# EAGLE design noise-generator (EAGLE 7.5.0)
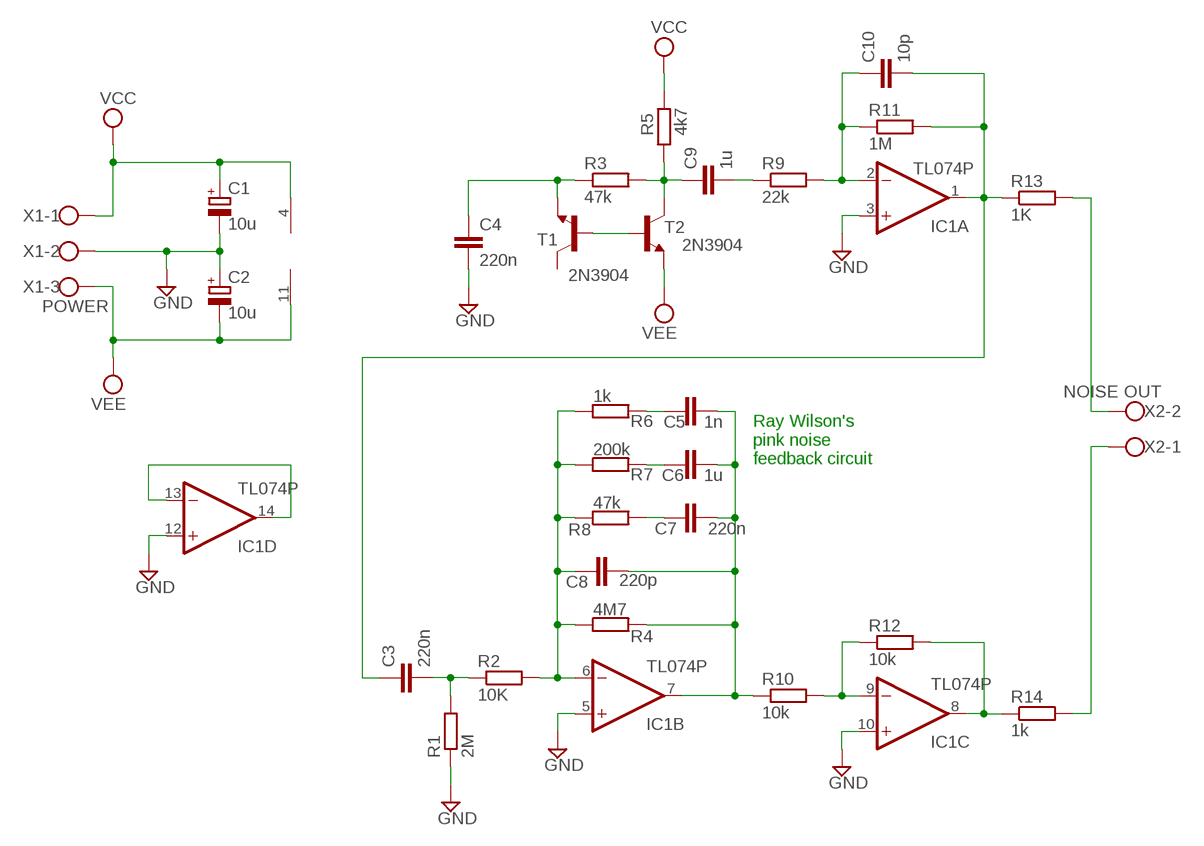
[diagram p0: schematic, sheet 1]

## Parts
C1  10u  CPOL-EUE1.8-4  [E1,8-4]
C2  10u  CPOL-EUE1.8-4  [E1,8-4]
C3  220n  C-EU050-024X044  [C050-024X044]
C4  220n  C-EU050-024X044  [C050-024X044]
C5  1n  C-EU050-024X044  [C050-024X044]
C6  1u  C-EU050-024X044  [C050-024X044]
C7  220n  C-EU050-024X044  [C050-024X044]
C8  220p  C-EU050-024X044  [C050-024X044]
C9  1u  C-EU050-024X044  [C050-024X044]
C10  10p  C-EU025-024X044  [C025-024X044]
IC1  TL074P  [DIL14]
R1  2M  R-EU_0204/7  [0204/7]
R2  10K  R-EU_0204/7  [0204/7]
R3  47k  R-EU_0204/7  [0204/7]
R4  4M7  R-EU_0204/7  [0204/7]
R5  4k7  R-EU_0204/7  [0204/7]
R6  1k  R-EU_0204/7  [0204/7]
R7  200k  R-EU_0204/7  [0204/7]
R8  47k  R-EU_0204/7  [0204/7]
R9  22k  R-EU_0204/7  [0204/7]
R10  10k  R-EU_0204/7  [0204/7]
R11  1M  R-EU_0204/7  [0204/7]
R12  10k  R-EU_0204/7  [0204/7]
R13  1K  R-EU_0204/7  [0204/7]
R14  1k  R-EU_0204/7  [0204/7]
T1  2N3904  [TO92]
T2  2N3904  [TO92]
X1  POWER  W237-103  [W237-103]
X2  NOISE OUT  W237-102  [W237-102]

## Nets
GND: C1.- C2.+ C4.2 IC1.3(A:+IN) IC1.5(B:+IN) IC1.10(C:+IN) IC1.12(D:+IN) R1.1 X1.2
N$1: C4.1 R3.1 T1.3(E)
N$2: IC1.9(C:-IN) R10.2 R12.1
N$3: C9.1 R3.2 R5.1 T2.1(C)
N$4: T1.2(B) T2.2(B)
N$5: C9.2 R9.1
N$6: C10.1 IC1.2(A:-IN) R9.2 R11.1
N$7: R13.2 X2.2
N$8: C3.1 C10.2 IC1.1(A:OUT) R11.2 R13.1
N$9: IC1.8(C:OUT) R12.2 R14.1
N$10: R14.2 X2.1
N$11: C8.1 IC1.6(B:-IN) R2.2 R4.1 R6.1 R7.1 R8.1
N$12: C3.2 R1.2 R2.1
N$13: IC1.13(D:-IN) IC1.14(D:OUT)
N$14: C6.1 R7.2
N$15: C5.1 R6.2
N$16: C7.1 R8.2
N$17: C5.2 C6.2 C7.2 C8.2 IC1.7(B:OUT) R4.2 R10.1
VCC: C1.+ IC1.4(P:V+) R5.2 X1.1
VEE: C2.- IC1.11(P:V-) T2.3(E) X1.3
Unconnected: T1.1(C)

## Notes on the sheet
- Ray Wilson's
  pink noise
  feedback circuit

## Library data of the parts
C1 C2 = rcl:CPOL-EU: POLARIZED CAPACITOR, European symbol
C3-C10 = rcl:C-EU: CAPACITOR, European symbol
IC1 = linear:TL074: OP AMP
R1-R14 = rcl:R-EU_: RESISTOR, European symbol
T1 T2 = transistor:2N3904: NPN TRANSISTOR
X1 = con-wago-500:W237-103: WAGO SCREW CLAMP; MPN: 237-103; OC_FARNELL: unknown; OC_NEWARK: 18M7116
X2 = con-wago-500:W237-102: WAGO SCREW CLAMP; MPN: 237-102; OC_FARNELL: unknown; OC_NEWARK: 70K9898

## Board
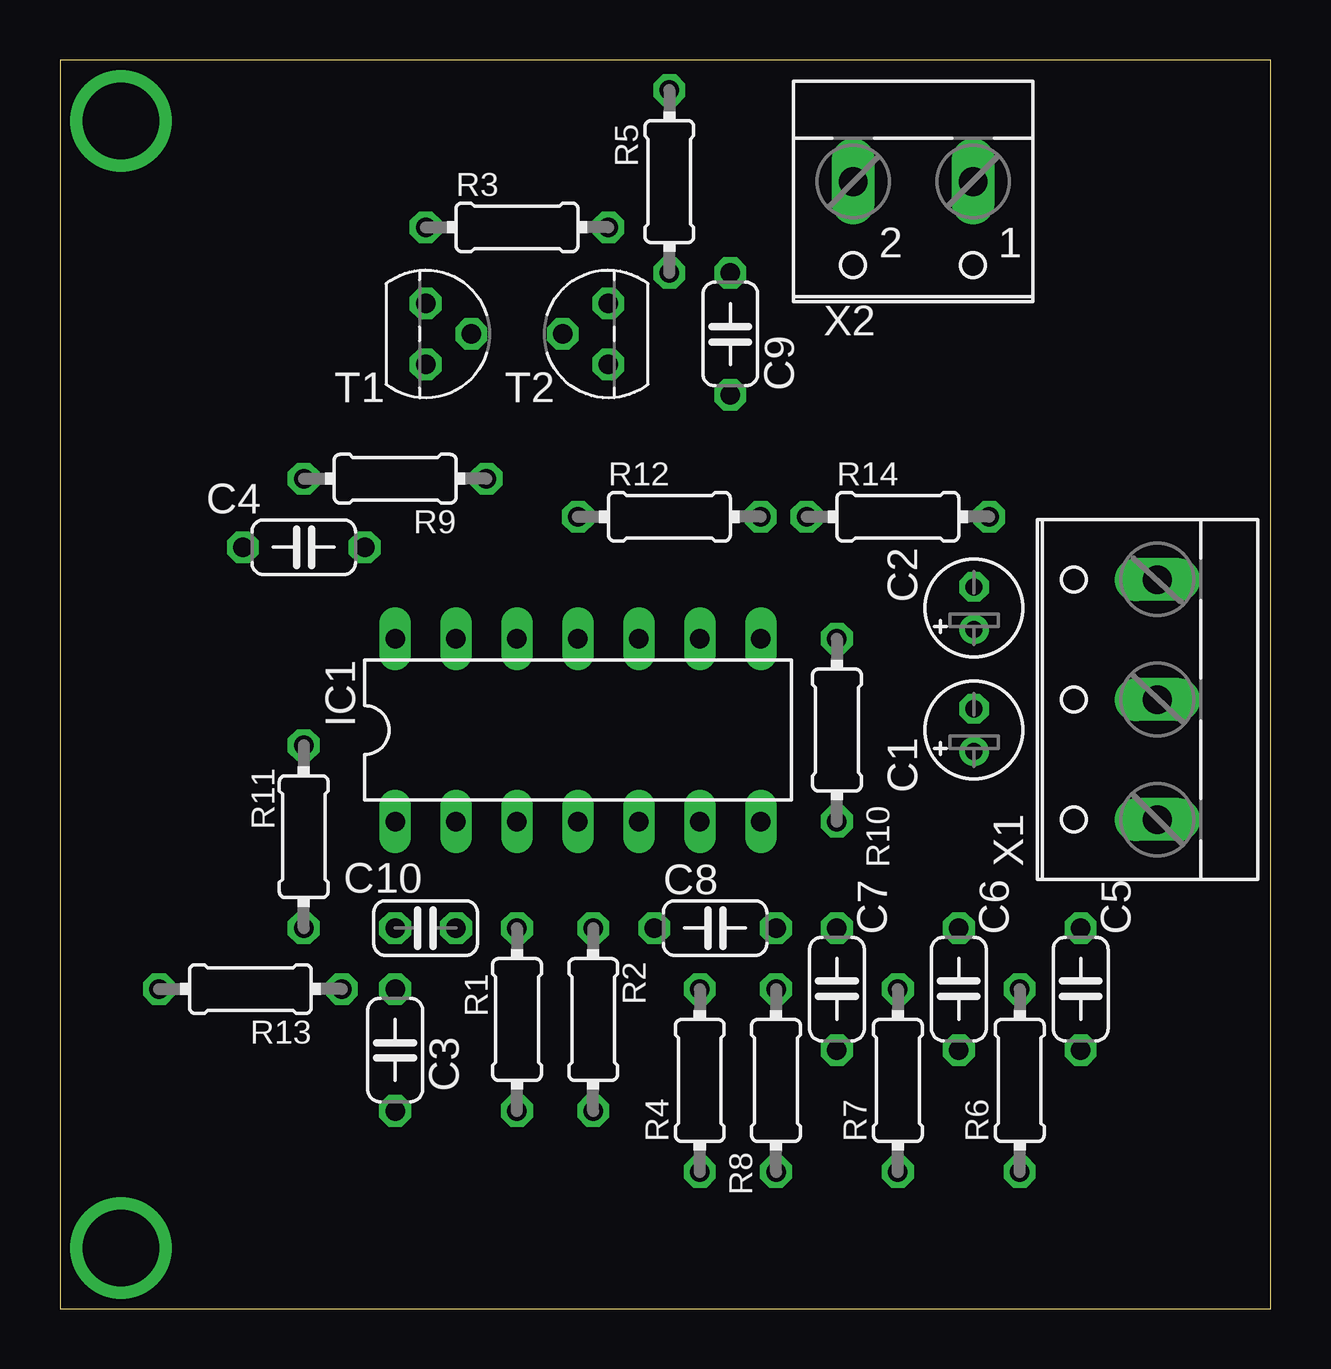
[diagram p1: board, top side]
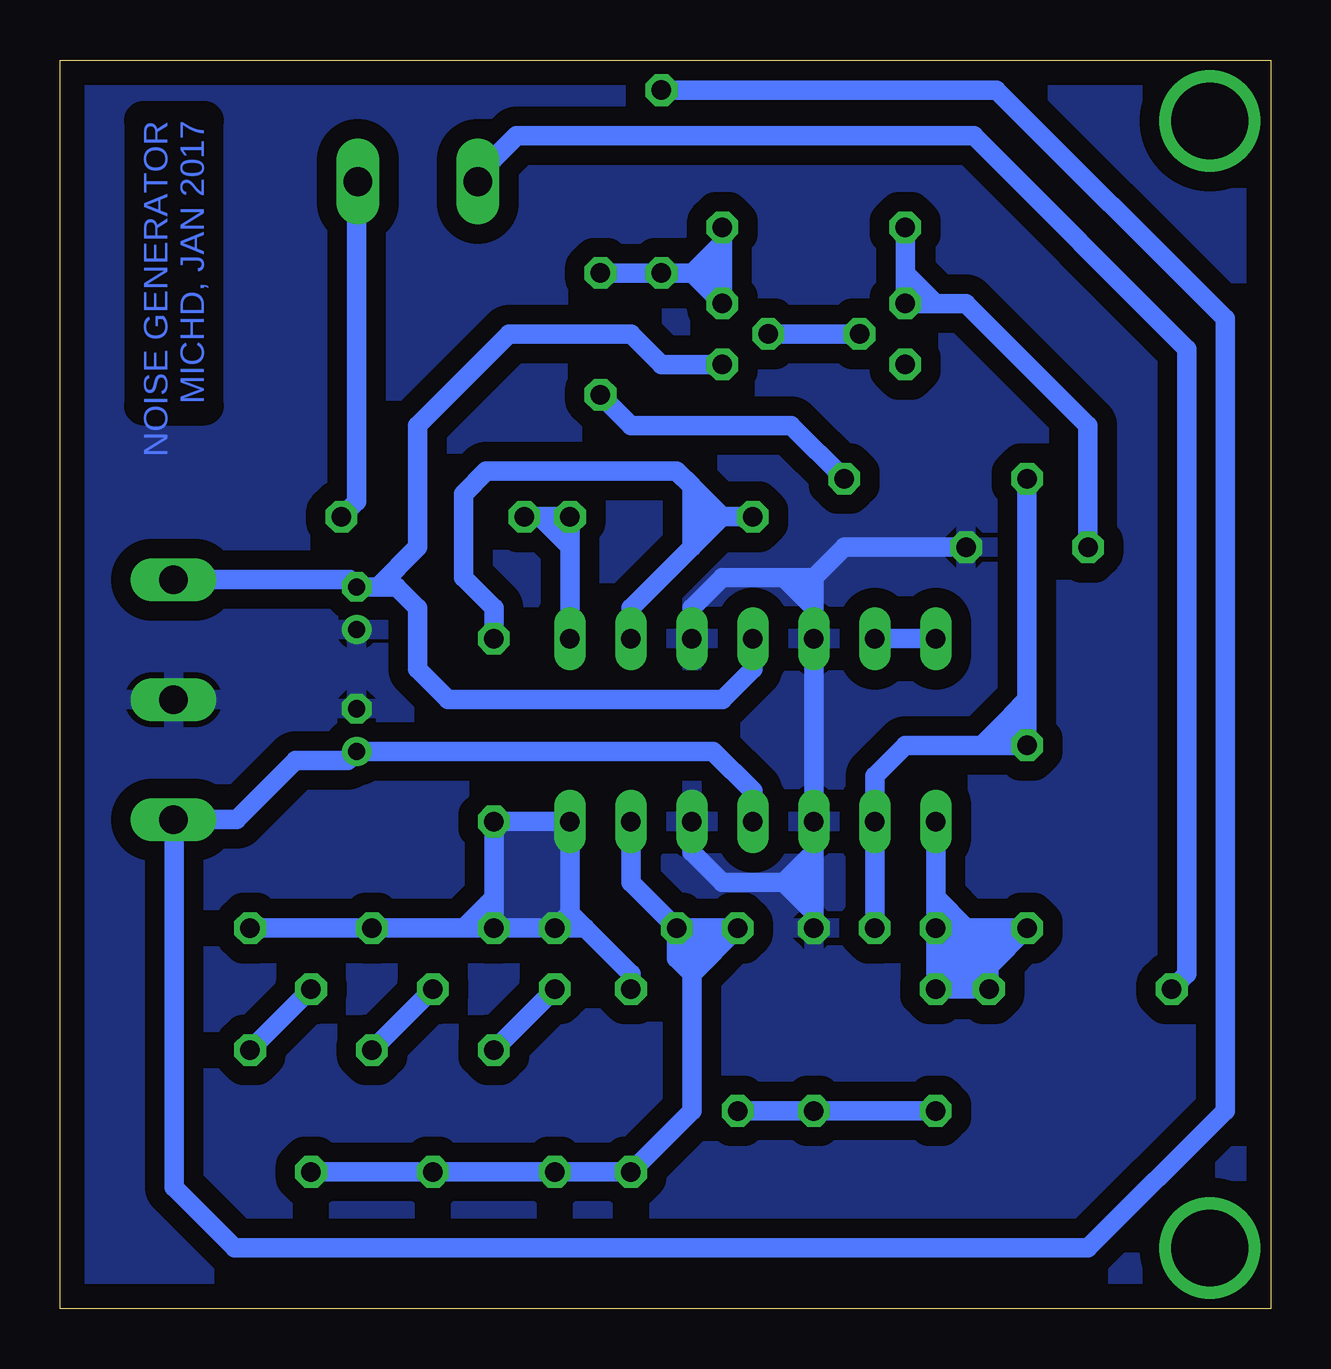
[diagram p2: board, bottom side, seen from below]

Size 50.47 x 52.06 mm. Coordinates in mm from the lower left corner, seen from the top.
Outline: 0,0 50.47,0 50.47,52.06 0,52.06 0,0
Copper layers (1*16): Top 0.035mm / dielectric 1.5mm / Bottom 0.035mm
Design rules "default": minimum track width 10mil, minimum drill 24mil, track to track 8mil, track to pad 8mil, pad to pad 8mil, via to via 8mil, smd to smd 8mil, copper to edge 40mil, drill to drill 8mil, minimum pad ring 10mil, minimum via ring 8mil, stop-mask expansion 4mil, vias tented up to drill 0mil, thermal gap 10mil

### Footprints (pad centres in the part's own frame; a part is rotated, then mirrored left to right if it is on the bottom)
E1,8-4 = drill 0.711 pad 1.168: + -0.889,0 | drill 0.711 pad 1.168 octagon: - 0.889,0
C050-024X044 = drill 0.813 octagon: 1 -2.54,0; 2 2.54,0
C025-024X044 = drill 0.813 octagon: 1 -1.27,0; 2 1.27,0
DIL14 = drill 0.813 long: 1 -7.62,-3.81; 2 -5.08,-3.81; 3 -2.54,-3.81; 4 0,-3.81; 5 2.54,-3.81; 6 5.08,-3.81; 7 7.62,-3.81; 8 7.62,3.81; 9 5.08,3.81; 10 2.54,3.81; 11 0,3.81; 12 -2.54,3.81; 13 -5.08,3.81; 14 -7.62,3.81
0204/7 = drill 0.813 octagon: 1 -3.81,0; 2 3.81,0
TO92 = drill 0.813 octagon: 1 1.27,0; 2 0,1.905; 3 -1.27,0
W237-103 = drill 1.194 long: 1 -5,-1.29; 2 0,-1.29; 3 5,-1.29
W237-102 = drill 1.194 long: 1 -2.5,-1.27; 2 2.5,-1.27

### Placement (x,y rotation side)
C1  38.1,24.13 90 top
C2  38.1,29.21 90 top
C3  13.97,10.79 270 top
C4  10.16,31.75 0 top
C5  42.55,13.34 90 top
C6  37.47,13.34 90 top
C7  32.38,13.34 90 top
C8  27.3,15.88 0 top
C9  27.94,40.64 270 top
C10  15.24,15.88 180 top
IC1  21.59,24.13 0 top
R1  19.05,12.06 270 top
R2  22.23,12.06 90 top
R3  19.05,45.09 0 top
R4  26.67,9.53 90 top
R5  25.4,46.99 90 top
R6  40.01,9.53 90 top
R7  34.92,9.53 90 top
R8  29.84,9.53 90 top
R9  13.97,34.61 180 top
R10  32.38,24.13 90 top
R11  10.16,19.68 270 top
R12  25.4,33.02 0 top
R13  7.94,13.34 180 top
R14  34.92,33.02 0 top
T1  15.24,40.64 270 top
T2  22.86,40.64 90 top
X1  44.45,25.4 90 top
X2  35.56,45.72 180 top

### Tracks (layer width: path | path; a pad name or v marks a point on that pad's centre or on a via)
GND
  Bottom 0.813: 19.05,17.78 19.05,19.05 | 19.05,19.05 IC1.3 IC1.12 | IC1.5 24.13,19.05 22.86,17.78 20.32,17.78 | IC1.12 19.05,29.21 20.32,30.48 | 20.32,30.48 22.86,30.48 24.13,29.21 IC1.10 | C4.2 17.78,31.75 19.05,30.48 | 19.05,30.48 IC1.12 | R1.1 19.05,16.51 | 19.05,16.51 19.05,17.78 | 19.05,17.78 20.32,17.78 | 20.32,30.48 19.05,30.48 | 19.05,19.05 20.32,17.78 | 20.32,17.78 19.05,16.51
  pour Bottom (isolate 0.813): 49.53,52.07 49.53,1.27 1.27,1.27 1.27,52.07
N$1
  Bottom 0.813: 15.24,43.18 T1.3 13.97,41.91 | 15.24,43.18 R3.1 | C4.1 7.62,36.83 12.7,41.91 13.97,41.91 | 13.97,41.91 15.24,43.18
N$2
  Bottom 0.813: 22.86,33.02 24.13,31.75 | 24.13,31.75 26.67,29.21 IC1.9 | R12.1 22.86,33.02 | 24.13,34.29 24.77,34.92 32.7,34.92 33.66,33.97 33.66,30.48 32.38,29.21 R10.2 | 24.13,34.29 22.86,33.02 | 24.13,31.75 24.13,33.66 | 24.13,34.29 24.13,33.66 | 24.13,33.66 23.5,33.02
N$3
  Bottom 0.813: C9.1 R5.1 24.13,43.18 | 24.13,43.18 T2.1 22.86,43.18 | 22.86,44.45 R3.2 | 22.86,43.18 22.86,44.45 | 22.86,44.45 24.13,43.18 | 24.13,43.18 22.86,43.18
N$4
  Bottom 0.813: T1.2 T2.2
N$5
  Bottom 0.813: C9.2 26.67,36.83 20,36.83 R9.1
N$6
  Bottom 0.813: 10.79,23.5 R11.1 10.16,25.4 | 12.06,23.5 15.24,23.5 16.51,22.23 IC1.2 C10.1 | R9.2 10.16,25.4 | 10.16,25.4 10.79,24.77 | 10.79,24.77 12.06,23.5 | 12.06,23.5 10.79,23.5 | 10.79,23.5 10.79,24.77
N$7
  Bottom 0.813: X2.2 33.02,47.03 33.34,46.99 31.43,48.9 12.38,48.9 3.49,40.01 3.49,13.97 R13.2
N$8
  Bottom 0.813: IC1.1 13.97,17.14 | 12.7,15.88 R11.2 11.75,14.29 | 12.7,15.88 C10.2 | C3.1 13.97,14.61 | 12.7,15.88 13.97,17.14 | 13.97,17.14 C10.2 | C10.2 13.97,14.61 | 13.97,14.61 13.65,14.92 | 13.65,14.92 12.7,15.88 | 11.75,14.29 R13.1 C3.1 | 11.75,14.29 11.75,14.61 12.7,15.56 12.06,15.56 11.75,15.24 11.43,15.24 11.11,15.56 | 11.75,14.92 13.65,14.92 | C3.1 13.97,13.65 13.34,14.29 13.02,14.29 12.7,13.97 | 12.7,13.97 12.38,13.97 12.06,14.29 12.38,14.29 12.7,14.61 12.7,13.97 | 12.7,13.97 13.02,13.65
N$9
  Bottom 0.813: 29.21,31.75 R12.2 30.48,33.02 | 29.21,31.75 IC1.8 | R14.1 30.48,33.02 | 29.21,31.75 30.48,33.02
N$10
  Bottom 0.813: X2.1 38.1,45.68 38.1,33.66 R14.2
N$11
  Bottom 0.813: C8.1 R2.2 24.13,13.97 | R6.1 R7.1 R8.1 R4.1 24.13,8.26 24.13,13.97 | IC1.6 26.67,17.78 C8.1 | C8.1 24.77,14.61 24.13,13.97 | 24.13,13.97 24.13,15.24 23.5,15.24
N$12
  Bottom 0.813: C3.2 R1.2 R2.1
N$13
  Bottom 0.813: IC1.13 IC1.14
N$14
  Bottom 0.813: C6.1 R7.2
N$15
  Bottom 0.813: C5.1 R6.2
N$16
  Bottom 0.813: R8.2 C7.1
N$17
  Bottom 0.813: C5.2 C6.2 33.66,15.88 | 33.66,15.88 C7.2 | R4.2 26.67,13.97 28.57,15.88 | 28.57,15.88 C8.2 | C8.2 C7.2 | 32.38,17.14 C7.2 | 32.38,17.14 R10.1 IC1.7 29.21,16.51 | 29.21,16.51 C8.2 | 32.38,17.14 33.66,15.88 | 29.21,16.51 28.57,15.88
  pour Bottom (no thermals): 29.21,20.32 32.38,20.32 32.38,15.88 29.84,15.88 29.21,16.51
N$18
  pour Bottom (isolate 0.813): 49.53,52.07 0,52.07 0,1.27 49.53,1.27
N$19  (via drill 3.2)
  other vias: 2.54,2.54
N$32  (via drill 3.2 pad 3.81)
  other vias: 2.54,49.52
VCC
  Bottom 0.813: IC1.4 21.59,21.59 23.24,23.24 C1.+ 38.48,22.86 40.64,22.86 43.1,20.4 X1.1 | 45.82,20.32 X1.1 | R5.2 11.43,50.8 1.91,41.27 1.91,8.26 7.62,2.54 43.18,2.54 45.72,5.08 45.72,20.38 X1.1
VEE
  Bottom 0.813: C2.- 36.45,30.1 35.56,29.21 35.56,26.67 34.29,25.4 22.86,25.4 21.59,26.67 IC1.11 | T2.3 25.4,39.37 26.67,40.64 31.75,40.64 35.56,36.83 35.56,31.75 37.21,30.1 C2.- | X1.3 38.4,30.4 C2.-

### Text on the board
Bottom: NOISE GENERATOR / MICHD, JAN 2017
tValues: PINK | WHITE | -5V | +5V